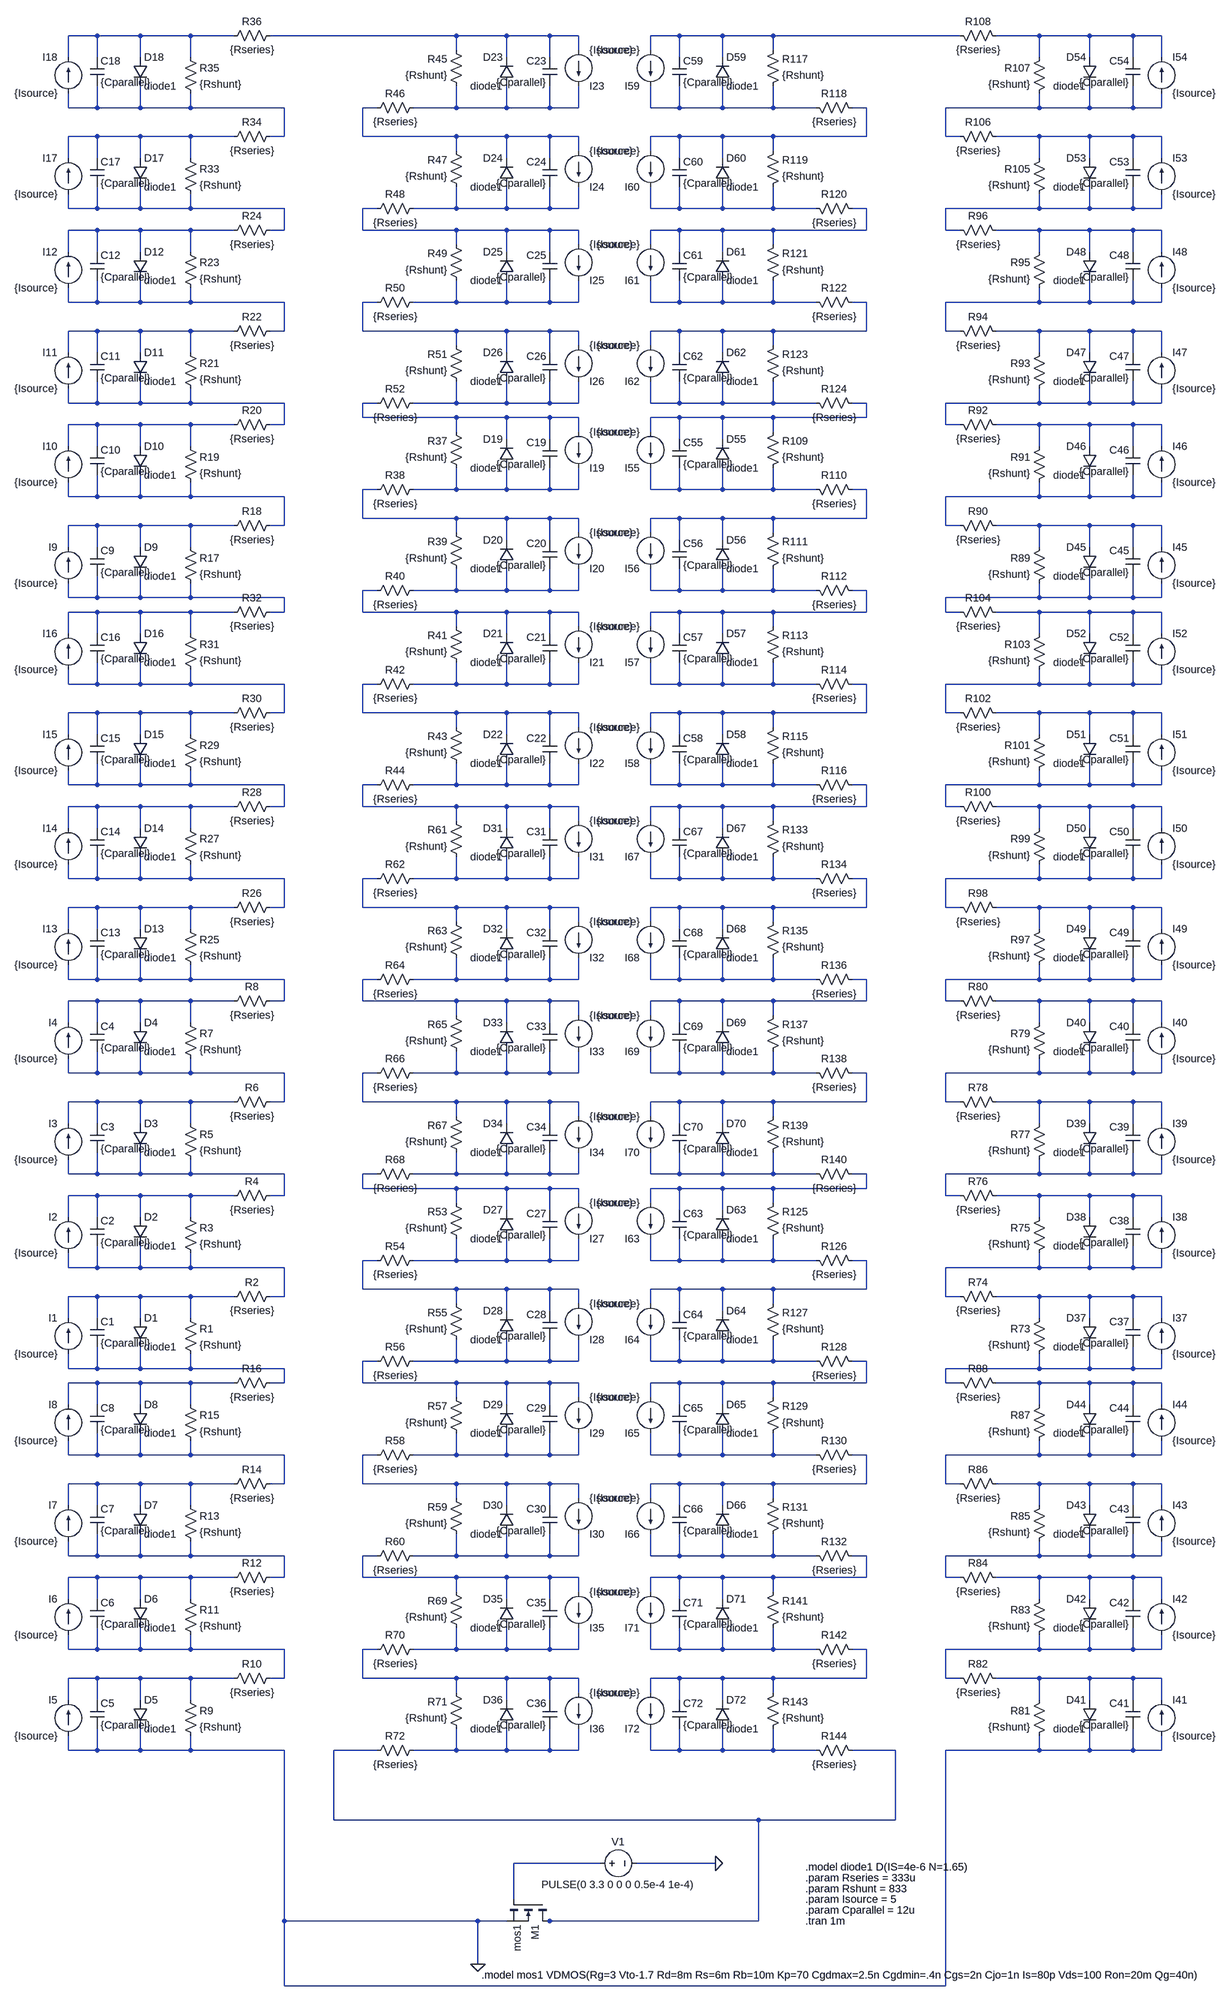
[diagram p0: schematic module-72cells.asc]
* module-72cells.asc
I1 N113 N107 {Isource}
C1 N107 N113 {Cparallel}
D1 N107 N113 diode1
R1 N107 N113 {Rshunt}
R2 N105 N107 {Rseries}
I2 N105 N099 {Isource}
C2 N099 N105 {Cparallel}
D2 N099 N105 diode1
R3 N099 N105 {Rshunt}
R4 N093 N099 {Rseries}
I3 N093 N091 {Isource}
C3 N091 N093 {Cparallel}
D3 N091 N093 diode1
R5 N091 N093 {Rshunt}
R6 N085 N091 {Rseries}
I4 N085 N083 {Isource}
C4 N083 N085 {Cparallel}
D4 N083 N085 diode1
R7 N083 N085 {Rshunt}
R8 N077 N083 {Rseries}
I5 0 N139 {Isource}
C5 N139 0 {Cparallel}
D5 N139 0 diode1
R9 N139 0 {Rshunt}
R10 N133 N139 {Rseries}
I6 N133 N131 {Isource}
C6 N131 N133 {Cparallel}
D6 N131 N133 diode1
R11 N131 N133 {Rshunt}
R12 N125 N131 {Rseries}
I7 N125 N123 {Isource}
C7 N123 N125 {Cparallel}
D7 N123 N125 diode1
R13 N123 N125 {Rshunt}
R14 N117 N123 {Rseries}
I8 N117 N115 {Isource}
C8 N115 N117 {Cparallel}
D8 N115 N117 diode1
R15 N115 N117 {Rshunt}
R16 N113 N115 {Rseries}
I9 N049 N043 {Isource}
C9 N043 N049 {Cparallel}
D9 N043 N049 diode1
R17 N043 N049 {Rshunt}
R18 N041 N043 {Rseries}
I10 N041 N035 {Isource}
C10 N035 N041 {Cparallel}
D10 N035 N041 diode1
R19 N035 N041 {Rshunt}
R20 N029 N035 {Rseries}
I11 N029 N027 {Isource}
C11 N027 N029 {Cparallel}
D11 N027 N029 diode1
R21 N027 N029 {Rshunt}
R22 N021 N027 {Rseries}
I12 N021 N019 {Isource}
C12 N019 N021 {Cparallel}
D12 N019 N021 diode1
R23 N019 N021 {Rshunt}
R24 N013 N019 {Rseries}
I13 N077 N075 {Isource}
C13 N075 N077 {Cparallel}
D13 N075 N077 diode1
R25 N075 N077 {Rshunt}
R26 N069 N075 {Rseries}
I14 N069 N067 {Isource}
C14 N067 N069 {Cparallel}
D14 N067 N069 diode1
R27 N067 N069 {Rshunt}
R28 N061 N067 {Rseries}
I15 N061 N059 {Isource}
C15 N059 N061 {Cparallel}
D15 N059 N061 diode1
R29 N059 N061 {Rshunt}
R30 N053 N059 {Rseries}
I16 N053 N051 {Isource}
C16 N051 N053 {Cparallel}
D16 N051 N053 diode1
R31 N051 N053 {Rshunt}
R32 N049 N051 {Rseries}
I17 N013 N011 {Isource}
C17 N011 N013 {Cparallel}
D17 N011 N013 diode1
R33 N011 N013 {Rshunt}
R34 N005 N011 {Rseries}
I18 N005 N001 {Isource}
C18 N001 N005 {Cparallel}
D18 N001 N005 diode1
R35 N001 N005 {Rshunt}
R36 N002 N001 {Rseries}
I19 N030 N038 {Isource}
C19 N038 N030 {Cparallel}
D19 N038 N030 diode1
R37 N038 N030 {Rshunt}
R38 N037 N038 {Rseries}
I20 N037 N046 {Isource}
C20 N046 N037 {Cparallel}
D20 N046 N037 diode1
R39 N046 N037 {Rshunt}
R40 N045 N046 {Rseries}
I21 N045 N055 {Isource}
C21 N055 N045 {Cparallel}
D21 N055 N045 diode1
R41 N055 N045 {Rshunt}
R42 N054 N055 {Rseries}
I22 N054 N063 {Isource}
C22 N063 N054 {Cparallel}
D22 N063 N054 diode1
R43 N063 N054 {Rshunt}
R44 N062 N063 {Rseries}
I23 N002 N007 {Isource}
C23 N007 N002 {Cparallel}
D23 N007 N002 diode1
R45 N007 N002 {Rshunt}
R46 N006 N007 {Rseries}
I24 N006 N015 {Isource}
C24 N015 N006 {Cparallel}
D24 N015 N006 diode1
R47 N015 N006 {Rshunt}
R48 N014 N015 {Rseries}
I25 N014 N023 {Isource}
C25 N023 N014 {Cparallel}
D25 N023 N014 diode1
R49 N023 N014 {Rshunt}
R50 N022 N023 {Rseries}
I26 N022 N031 {Isource}
C26 N031 N022 {Cparallel}
D26 N031 N022 diode1
R51 N031 N022 {Rshunt}
R52 N030 N031 {Rseries}
I27 N094 N102 {Isource}
C27 N102 N094 {Cparallel}
D27 N102 N094 diode1
R53 N102 N094 {Rshunt}
R54 N101 N102 {Rseries}
I28 N101 N110 {Isource}
C28 N110 N101 {Cparallel}
D28 N110 N101 diode1
R55 N110 N101 {Rshunt}
R56 N109 N110 {Rseries}
I29 N109 N119 {Isource}
C29 N119 N109 {Cparallel}
D29 N119 N109 diode1
R57 N119 N109 {Rshunt}
R58 N118 N119 {Rseries}
I30 N118 N127 {Isource}
C30 N127 N118 {Cparallel}
D30 N127 N118 diode1
R59 N127 N118 {Rshunt}
R60 N126 N127 {Rseries}
I31 N062 N071 {Isource}
C31 N071 N062 {Cparallel}
D31 N071 N062 diode1
R61 N071 N062 {Rshunt}
R62 N070 N071 {Rseries}
I32 N070 N079 {Isource}
C32 N079 N070 {Cparallel}
D32 N079 N070 diode1
R63 N079 N070 {Rshunt}
R64 N078 N079 {Rseries}
I33 N078 N087 {Isource}
C33 N087 N078 {Cparallel}
D33 N087 N078 diode1
R65 N087 N078 {Rshunt}
R66 N086 N087 {Rseries}
I34 N086 N095 {Isource}
C34 N095 N086 {Cparallel}
D34 N095 N086 diode1
R67 N095 N086 {Rshunt}
R68 N094 N095 {Rseries}
I35 N126 N135 {Isource}
C35 N135 N126 {Cparallel}
D35 N135 N126 diode1
R69 N135 N126 {Rshunt}
R70 N134 N135 {Rseries}
I36 N134 N142 {Isource}
C36 N142 N134 {Cparallel}
D36 N142 N134 diode1
R71 N142 N134 {Rshunt}
R72 N141 N142 {Rseries}
M1 N141 N144 0 0 mos1
V1 N144 0 PULSE(0 3.3 0 0 0 0.5e-4 1e-4)
I37 N114 N108 {Isource}
C37 N108 N114 {Cparallel}
D37 N108 N114 diode1
R73 N108 N114 {Rshunt}
R74 N106 N108 {Rseries}
I38 N106 N100 {Isource}
C38 N100 N106 {Cparallel}
D38 N100 N106 diode1
R75 N100 N106 {Rshunt}
R76 N098 N100 {Rseries}
I39 N098 N092 {Isource}
C39 N092 N098 {Cparallel}
D39 N092 N098 diode1
R77 N092 N098 {Rshunt}
R78 N090 N092 {Rseries}
I40 N090 N084 {Isource}
C40 N084 N090 {Cparallel}
D40 N084 N090 diode1
R79 N084 N090 {Rshunt}
R80 N082 N084 {Rseries}
I41 0 N140 {Isource}
C41 N140 0 {Cparallel}
D41 N140 0 diode1
R81 N140 0 {Rshunt}
R82 N138 N140 {Rseries}
I42 N138 N132 {Isource}
C42 N132 N138 {Cparallel}
D42 N132 N138 diode1
R83 N132 N138 {Rshunt}
R84 N130 N132 {Rseries}
I43 N130 N124 {Isource}
C43 N124 N130 {Cparallel}
D43 N124 N130 diode1
R85 N124 N130 {Rshunt}
R86 N122 N124 {Rseries}
I44 N122 N116 {Isource}
C44 N116 N122 {Cparallel}
D44 N116 N122 diode1
R87 N116 N122 {Rshunt}
R88 N114 N116 {Rseries}
I45 N050 N044 {Isource}
C45 N044 N050 {Cparallel}
D45 N044 N050 diode1
R89 N044 N050 {Rshunt}
R90 N042 N044 {Rseries}
I46 N042 N036 {Isource}
C46 N036 N042 {Cparallel}
D46 N036 N042 diode1
R91 N036 N042 {Rshunt}
R92 N034 N036 {Rseries}
I47 N034 N028 {Isource}
C47 N028 N034 {Cparallel}
D47 N028 N034 diode1
R93 N028 N034 {Rshunt}
R94 N026 N028 {Rseries}
I48 N026 N020 {Isource}
C48 N020 N026 {Cparallel}
D48 N020 N026 diode1
R95 N020 N026 {Rshunt}
R96 N018 N020 {Rseries}
I49 N082 N076 {Isource}
C49 N076 N082 {Cparallel}
D49 N076 N082 diode1
R97 N076 N082 {Rshunt}
R98 N074 N076 {Rseries}
I50 N074 N068 {Isource}
C50 N068 N074 {Cparallel}
D50 N068 N074 diode1
R99 N068 N074 {Rshunt}
R100 N066 N068 {Rseries}
I51 N066 N060 {Isource}
C51 N060 N066 {Cparallel}
D51 N060 N066 diode1
R101 N060 N066 {Rshunt}
R102 N058 N060 {Rseries}
I52 N058 N052 {Isource}
C52 N052 N058 {Cparallel}
D52 N052 N058 diode1
R103 N052 N058 {Rshunt}
R104 N050 N052 {Rseries}
I53 N018 N012 {Isource}
C53 N012 N018 {Cparallel}
D53 N012 N018 diode1
R105 N012 N018 {Rshunt}
R106 N010 N012 {Rseries}
I54 N010 N004 {Isource}
C54 N004 N010 {Cparallel}
D54 N004 N010 diode1
R107 N004 N010 {Rshunt}
R108 N003 N004 {Rseries}
I55 N033 N039 {Isource}
C55 N039 N033 {Cparallel}
D55 N039 N033 diode1
R109 N039 N033 {Rshunt}
R110 N040 N039 {Rseries}
I56 N040 N047 {Isource}
C56 N047 N040 {Cparallel}
D56 N047 N040 diode1
R111 N047 N040 {Rshunt}
R112 N048 N047 {Rseries}
I57 N048 N056 {Isource}
C57 N056 N048 {Cparallel}
D57 N056 N048 diode1
R113 N056 N048 {Rshunt}
R114 N057 N056 {Rseries}
I58 N057 N064 {Isource}
C58 N064 N057 {Cparallel}
D58 N064 N057 diode1
R115 N064 N057 {Rshunt}
R116 N065 N064 {Rseries}
I59 N003 N008 {Isource}
C59 N008 N003 {Cparallel}
D59 N008 N003 diode1
R117 N008 N003 {Rshunt}
R118 N009 N008 {Rseries}
I60 N009 N016 {Isource}
C60 N016 N009 {Cparallel}
D60 N016 N009 diode1
R119 N016 N009 {Rshunt}
R120 N017 N016 {Rseries}
I61 N017 N024 {Isource}
C61 N024 N017 {Cparallel}
D61 N024 N017 diode1
R121 N024 N017 {Rshunt}
R122 N025 N024 {Rseries}
I62 N025 N032 {Isource}
C62 N032 N025 {Cparallel}
D62 N032 N025 diode1
R123 N032 N025 {Rshunt}
R124 N033 N032 {Rseries}
I63 N097 N103 {Isource}
C63 N103 N097 {Cparallel}
D63 N103 N097 diode1
R125 N103 N097 {Rshunt}
R126 N104 N103 {Rseries}
I64 N104 N111 {Isource}
C64 N111 N104 {Cparallel}
D64 N111 N104 diode1
R127 N111 N104 {Rshunt}
R128 N112 N111 {Rseries}
I65 N112 N120 {Isource}
C65 N120 N112 {Cparallel}
D65 N120 N112 diode1
R129 N120 N112 {Rshunt}
R130 N121 N120 {Rseries}
I66 N121 N128 {Isource}
C66 N128 N121 {Cparallel}
D66 N128 N121 diode1
R131 N128 N121 {Rshunt}
R132 N129 N128 {Rseries}
I67 N065 N072 {Isource}
C67 N072 N065 {Cparallel}
D67 N072 N065 diode1
R133 N072 N065 {Rshunt}
R134 N073 N072 {Rseries}
I68 N073 N080 {Isource}
C68 N080 N073 {Cparallel}
D68 N080 N073 diode1
R135 N080 N073 {Rshunt}
R136 N081 N080 {Rseries}
I69 N081 N088 {Isource}
C69 N088 N081 {Cparallel}
D69 N088 N081 diode1
R137 N088 N081 {Rshunt}
R138 N089 N088 {Rseries}
I70 N089 N096 {Isource}
C70 N096 N089 {Cparallel}
D70 N096 N089 diode1
R139 N096 N089 {Rshunt}
R140 N097 N096 {Rseries}
I71 N129 N136 {Isource}
C71 N136 N129 {Cparallel}
D71 N136 N129 diode1
R141 N136 N129 {Rshunt}
R142 N137 N136 {Rseries}
I72 N137 N143 {Isource}
C72 N143 N137 {Cparallel}
D72 N143 N137 diode1
R143 N143 N137 {Rshunt}
R144 N141 N143 {Rseries}
.model D D
.lib standard.dio
.model NMOS NMOS
.model PMOS PMOS
.lib standard.mos
.model diode1 D(IS=4e-6 N=1.65)
.tran 1m
.param Rshunt = 833
.param Rseries = 333u
.param Isource = 5
.param Cparallel = 12u
.model mos1 VDMOS(Rg=3 Vto-1.7 Rd=8m Rs=6m Rb=10m Kp=70 Cgdmax=2.5n Cgdmin=.4n Cgs=2n Cjo=1n Is=80p Vds=100 Ron=20m Qg=40n)
.backanno
.end